# Altium schematic sheet lab1_patrusheva_usb_spi.SchDoc: =title_line_1 + title_line_2
size 420 x 297 mm; SheetNumber: 1
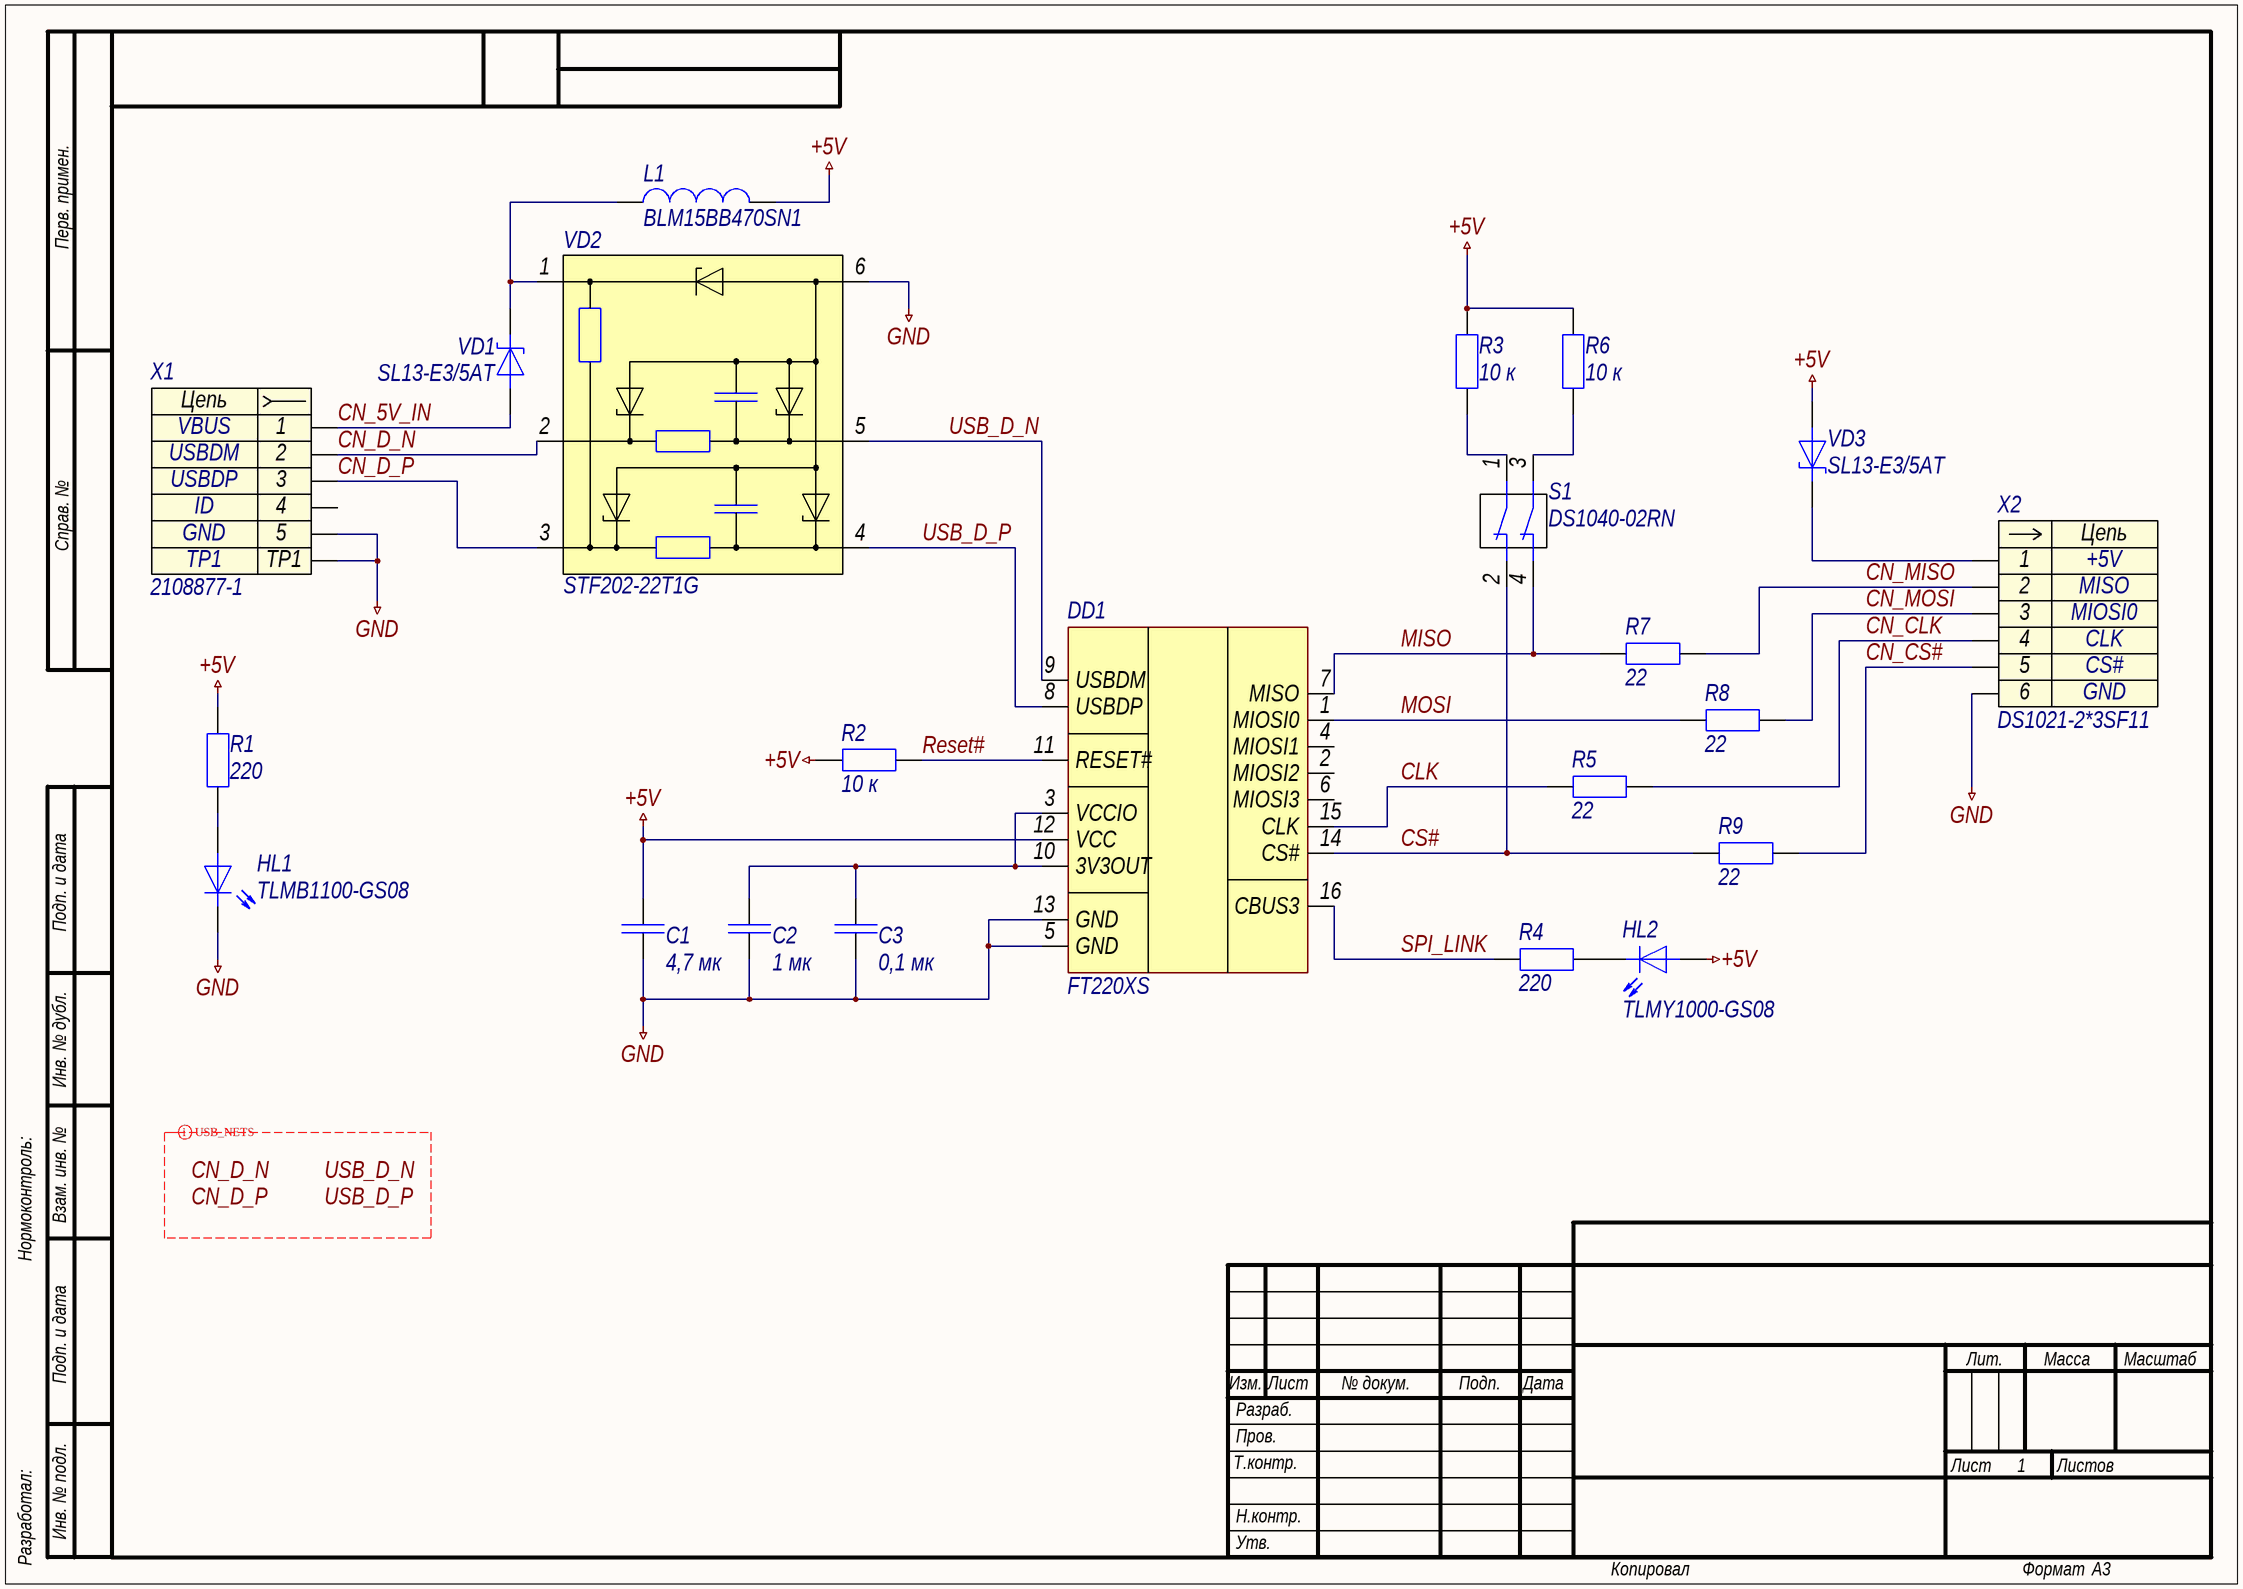
[diagram p0: lab1_patrusheva_usb_spi.SchDoc]

## Parts
C1  4,7 мк  [C0603]
C2  1 мк  [C0603]
C3  0,1 мк  [C0603]
DD1  FT220XS  [SSOP-16]
HL1  TLMB1100-GS08  [HL0603]
HL2  TLMY1000-GS08  [HL0603]
L1  BLM15BB470SN1  [BLM31PG330SN1]
R1  220  [R0603]
R2  10 к  [R0603]
R3  10 к  [R0603]
R4  220  [R0603]
R5  22  [R0603]
R6  10 к  [R0603]
R7  22  [R0603]
R8  22  [R0603]
R9  22  [R0603]
S1  DS1040-02RN  [DS1040-02RN]
VD1  SL13-E3/5AT  [DO-214AC]
VD2  STF202-22T1G  [tsop-6]
VD3  SL13-E3/5AT  [DO-214AC]
X1  2108877-1  [2108877-1]
X2  DS1021-2*3SF11  [DS1021-2X3SF11]

## Nets
+5V: C1.2 DD1.12(VCC) HL2.2 L1.2 R1.2 R2.1 R3.2 R6.2 VD3.2
GND: C1.1 C2.1 C3.1 DD1.5(GND) DD1.13(GND) HL1.1 VD2.6 X1.5 X1.TP1 X2.6
CLK: DD1.15(CLK) R5.1
CN_5V_IN: VD1.1 X1.1
CN_CLK: R5.2 X2.4
CN_CS#: R9.2 X2.5
CN_D_N: VD2.2 X1.2
CN_D_P: VD2.3 X1.3
CN_MISO: R7.2 X2.2
CN_MOSI: R8.2 X2.3
CS#: DD1.14(CS#) R9.1 S1.2
MISO: DD1.7(MISO) R7.1 S1.4
MOSI: DD1.1(MIOSI0) R8.1
Reset#: DD1.11(RESET#) R2.2
SPI_LINK: DD1.16(CBUS3) R4.1
USB_D_N: DD1.9(USBDM) VD2.5
USB_D_P: DD1.8(USBDP) VD2.4
NetC2_2: C2.2 C3.2 DD1.3(VCCIO) DD1.10(3V3OUT)
NetHL1_2: HL1.2 R1.1
NetHL2_1: HL2.1 R4.2
NetL1_1: L1.1 VD1.1 VD2.1
NetR3_1: R3.1 S1.1
NetR6_1: R6.1 S1.3
NetVD3_1: VD3.1 X2.1

Not connected (* = marked no-connect by the designer): DD1 2(MIOSI2) 4(MIOSI1) 6(MIOSI3); X1 4

## Layout directives
differential pair; rule Differential Pairs Routing [Pref Gap = 0.254mm    Min Gap  = 0.15mm    Max Gap  = 0.254mmPref Width = 0.381mm    Min Width  = 0.155mm    Max Width  = 0.381mm]; differential pair class USB_SIGNALS: CN_D_N, CN_D_P, USB_D_N, USB_D_P

## Notes on the sheet
- Labels drawn without touching a wire or pin: CN_D_N, CN_D_P, USB_D_N, USB_D_P
- Перв. примен.
- Справ. №
- Подп. и дата
- Инв. № дубл.
- Нормоконтроль:
- Взам. инв. №
- Изм.
- Лист
- № докум.
- Подп.
- Дата
- Лит.
- Масса
- Масштаб
- Т.контр.
- Пров.
- Разраб.
- Листов
- Разработал:
- Инв. № подл.
- Н.контр.
- Утв.
- Копировал
- Формат
- А3
- (in symbol x0001) Цепь
- (in symbol x0003) Цепь

## Library data of the parts
C1 = c0006: =Описание; ID: c0006; Фамилия: Ларионов; Описание: Конденсатор чип 0603 4,7 мкФ 25 В ±10 %; Наименование: CC0603KRX5R8BB475; Производитель: Yageo; Отклонение: ±10 %; Номинальное напряжение: 25 В; Рабочие температуры: от -55 °С до +85 °С; Корпус: 0603; Номинал: 4,7 мк; HelpURL: https://www.yageo.com/upload/media/product/productsearch/datasheet/mlcc/UPY-GPHC_X5R_4V-to-50V_26.pdf
C2 = c0004: =Описание; ID: c0004; Фамилия: Ларионов; Описание: Конденсатор чип 0603 1 мкФ 25 В ±10 %; Наименование: CC0603KRX7R8BB105; Производитель: Yageo; Отклонение: ±10 %; Номинальное напряжение: 25 В; Рабочие температуры: от -55 °С до +125 °С; Корпус: 0603; Номинал: 1 мк; HelpURL: https://www.yageo.com/upload/media/product/products/datasheet/mlcc/UPY-GPHC_X7R_6.3V-to-50V_20.pdf
C3 = c0002: =Описание; ID: c0002; Фамилия: Ларионов; Описание: Конденсатор чип 0603 0,1 мкФ 50 В ±5 %; Наименование: CC0603JRX7R9BB104; Производитель: Yageo; Отклонение: ±5 %; Номинальное напряжение: 50 В; Рабочие температуры: от -55 °С до +125 °С; Корпус: 0603; Номинал: 0,1 мк; HelpURL: https://www.yageo.com/upload/media/product/products/datasheet/mlcc/UPY-GPHC_X7R_6.3V-to-50V_20.pdf
DD1 = dd0005: =Описание; ID: dd0005; Фамилия: Патрушева, Игнатоа; Описание: Преобразователь USB-SPI; Производитель: FTDI Chip; Наименование: FT220XS; Корпус: SSOP-16; HelpURL: https://www.analog.com/ru/products/adm3485.html#product-samplebuy
HL1 = hl0006: =Описание; ID: hl0006; Фамилия: Ларионов; Описание: Светодиод чип 0603 синий; Производитель: Vishay Intertechnology, Inc.; Цвет: Blue; Номинальная сила света: 5 мкд; Номинальная длина волны: 466 нм; Номинальный прямой ток: 30 мА; Номинальное падение напряжения: 3,9 В; Рассеиваемая мощность: 90 мВт; Рабочие температуры: от -40 °С до +100 °С; Корпус: 0603; Примечание: Not for new design; Наименование: TLMB1100-GS08; HelpURL: https://www.vishay.com/leds/list/product-83173/
HL2 = hl0003: =Описание; ID: hl0003; Фамилия: Ларионов; Описание: Светодиод чип 0603 желтый; Производитель: Vishay Intertechnology, Inc.; Цвет: Yellow; Номинальная сила света: 7,5 мкд; Номинальная длина волны: 588 нм; Номинальный прямой ток: 15 мА; Номинальное падение напряжения: 1,8 В; Рассеиваемая мощность: 40 мВт; Рабочие температуры: от -40 °С до +100 °С; Корпус: 0603; Наименование: TLMY1000-GS08; HelpURL: https://www.vishay.com/leds/list/product-83172/
L1 = l0003: =Описание; ID: l0003; Фамилия: Патрушева, Игнатова; Описание: Ферритовая бусина 47 Ом ±25 %; Производитель: Murata Manufacturing Co., Ltd.; Сопротивление, 100 МГц: 47 Ом; Отклонение, 100 Мгц: ±25 %; Сопротивление при постоянном токе: 0,35 Ом; Рабочие температуры: от -55 °С до +125 °С; Корпус: 0402; Наименование: BLM15BB470SN1; HelpURL: https://www.murata.com/en-global/products/productdetail.aspx?partno=BLM15BB470SN1%23
R1 R4 = r0005: =Описание; ID: r0005; Фамилия: Ларионов; Описание: Резистор чип 0603 220 Ом ±1 % 0,1 Вт; Наименование: RC0603FR-07220RL; Производитель: Yageo; Отклонение: ±1 %; Номинальное напряжение: 75 В; Рабочие температуры: от -55 °С до +155 °С; Номинальный ток: 1 А; Корпус: 0603; Номинал: 220; HelpURL: https://www.yageo.com/upload/media/product/productsearch/datasheet/rchip/PYu-RC_Group_51_RoHS_L_11.pdf
R2 R3 R6 = r0008: =Описание; ID: r0008; Фамилия: Самарин; Описание: Резистор чип 0603 10 кОм ±1 % 0,1 Вт; Наименование: RC0603FR-0710KL; Производитель: Yageo; Отклонение: ±1 %; Номинальное напряжение: 75 В; Рабочие температуры: от -55 °С до +155 °С; Номинальный ток: 1 А; Корпус: 0603; Номинал: 10 к; HelpURL: https://www.yageo.com/upload/media/product/productsearch/datasheet/rchip/PYu-RC_Group_51_RoHS_L_11.pdf
R5 R7-R9 = r0003: =Описание; ID: r0003; Фамилия: Ларионов; Описание: Резистор чип 0603 22 Ом ±1 % 0,1 Вт; Наименование: RC0603FR-0722R; Производитель: Yageo; Отклонение: ±1 %; Номинальное напряжение: 75 В; Рабочие температуры: от -55 °С до +155 °С; Номинальный ток: 1 А; Корпус: 0603; Номинал: 22; HelpURL: https://www.yageo.com/upload/media/product/productsearch/datasheet/rchip/PYu-RC_Group_51_RoHS_L_11.pdf
S1 = Component_1
VD1 VD3 = vd0001: =Описание; ID: vd0001; Фамилия: Ларионов; Описание: Диод Шоттки 30 В 1,5 А; Производитель: Vishay Intertechnology, Inc.; Пиковое прямое напряжение: 0,445 В; Импульсное обратное напряжение: 30 В; Макс# допустимый средний прямой ток: 1,5 А; Рабочие температуры: от -55 °С до +125 °С; Наименование: SL13-E3/5AT; Корпус: DO-214AC; HelpURL: https://www.vishay.com/product?docid=88740
VD2 = vd0006: =Описание; ID: vd0006; Фамилия: Патрушева, Игнатова; Описание: Диодная сборка для подавления помех, 5 В; Производитель: ON Semiconductor; Корпус: TSOP−6; Наименование: STF202-22T1G; HelpURL: https://www.onsemi.com/pub/Collateral/STF202-22T1-D.PDF
X1 = x0001: Contact_1: VBUS; Contact_2: USBDM; Contact_3: USBDP; Contact_4: ID; Contact_5: GND; ID: x0001; Фамилия: Ларионов; Описание: USB 2.0 Micro USB Type B IP68 гнездо прямой угол; Производитель: TE Connectivity; Наименование: 2108877-1; HelpURL: https://www.te.com/global-en/product-2108877-1.html
X2 = x0003: Contact_1: +5V; Contact_2: MISO; Contact_3: MIOSI0; Contact_4: CLK; Contact_5: CS#; Contact_6: GND; ID: x0003; Фамилия: Самарин; Описание: PLS 3x2 pin 2,54 мм прямой; Производитель: Connfly Electronic Co. LTD; Наименование: DS1021-2*3SF11; HelpURL: http://www.connfly.com/productshow.aspx?id=118